# EAGLE design Pi MCU shield 2 (EAGLE 8.7.0)
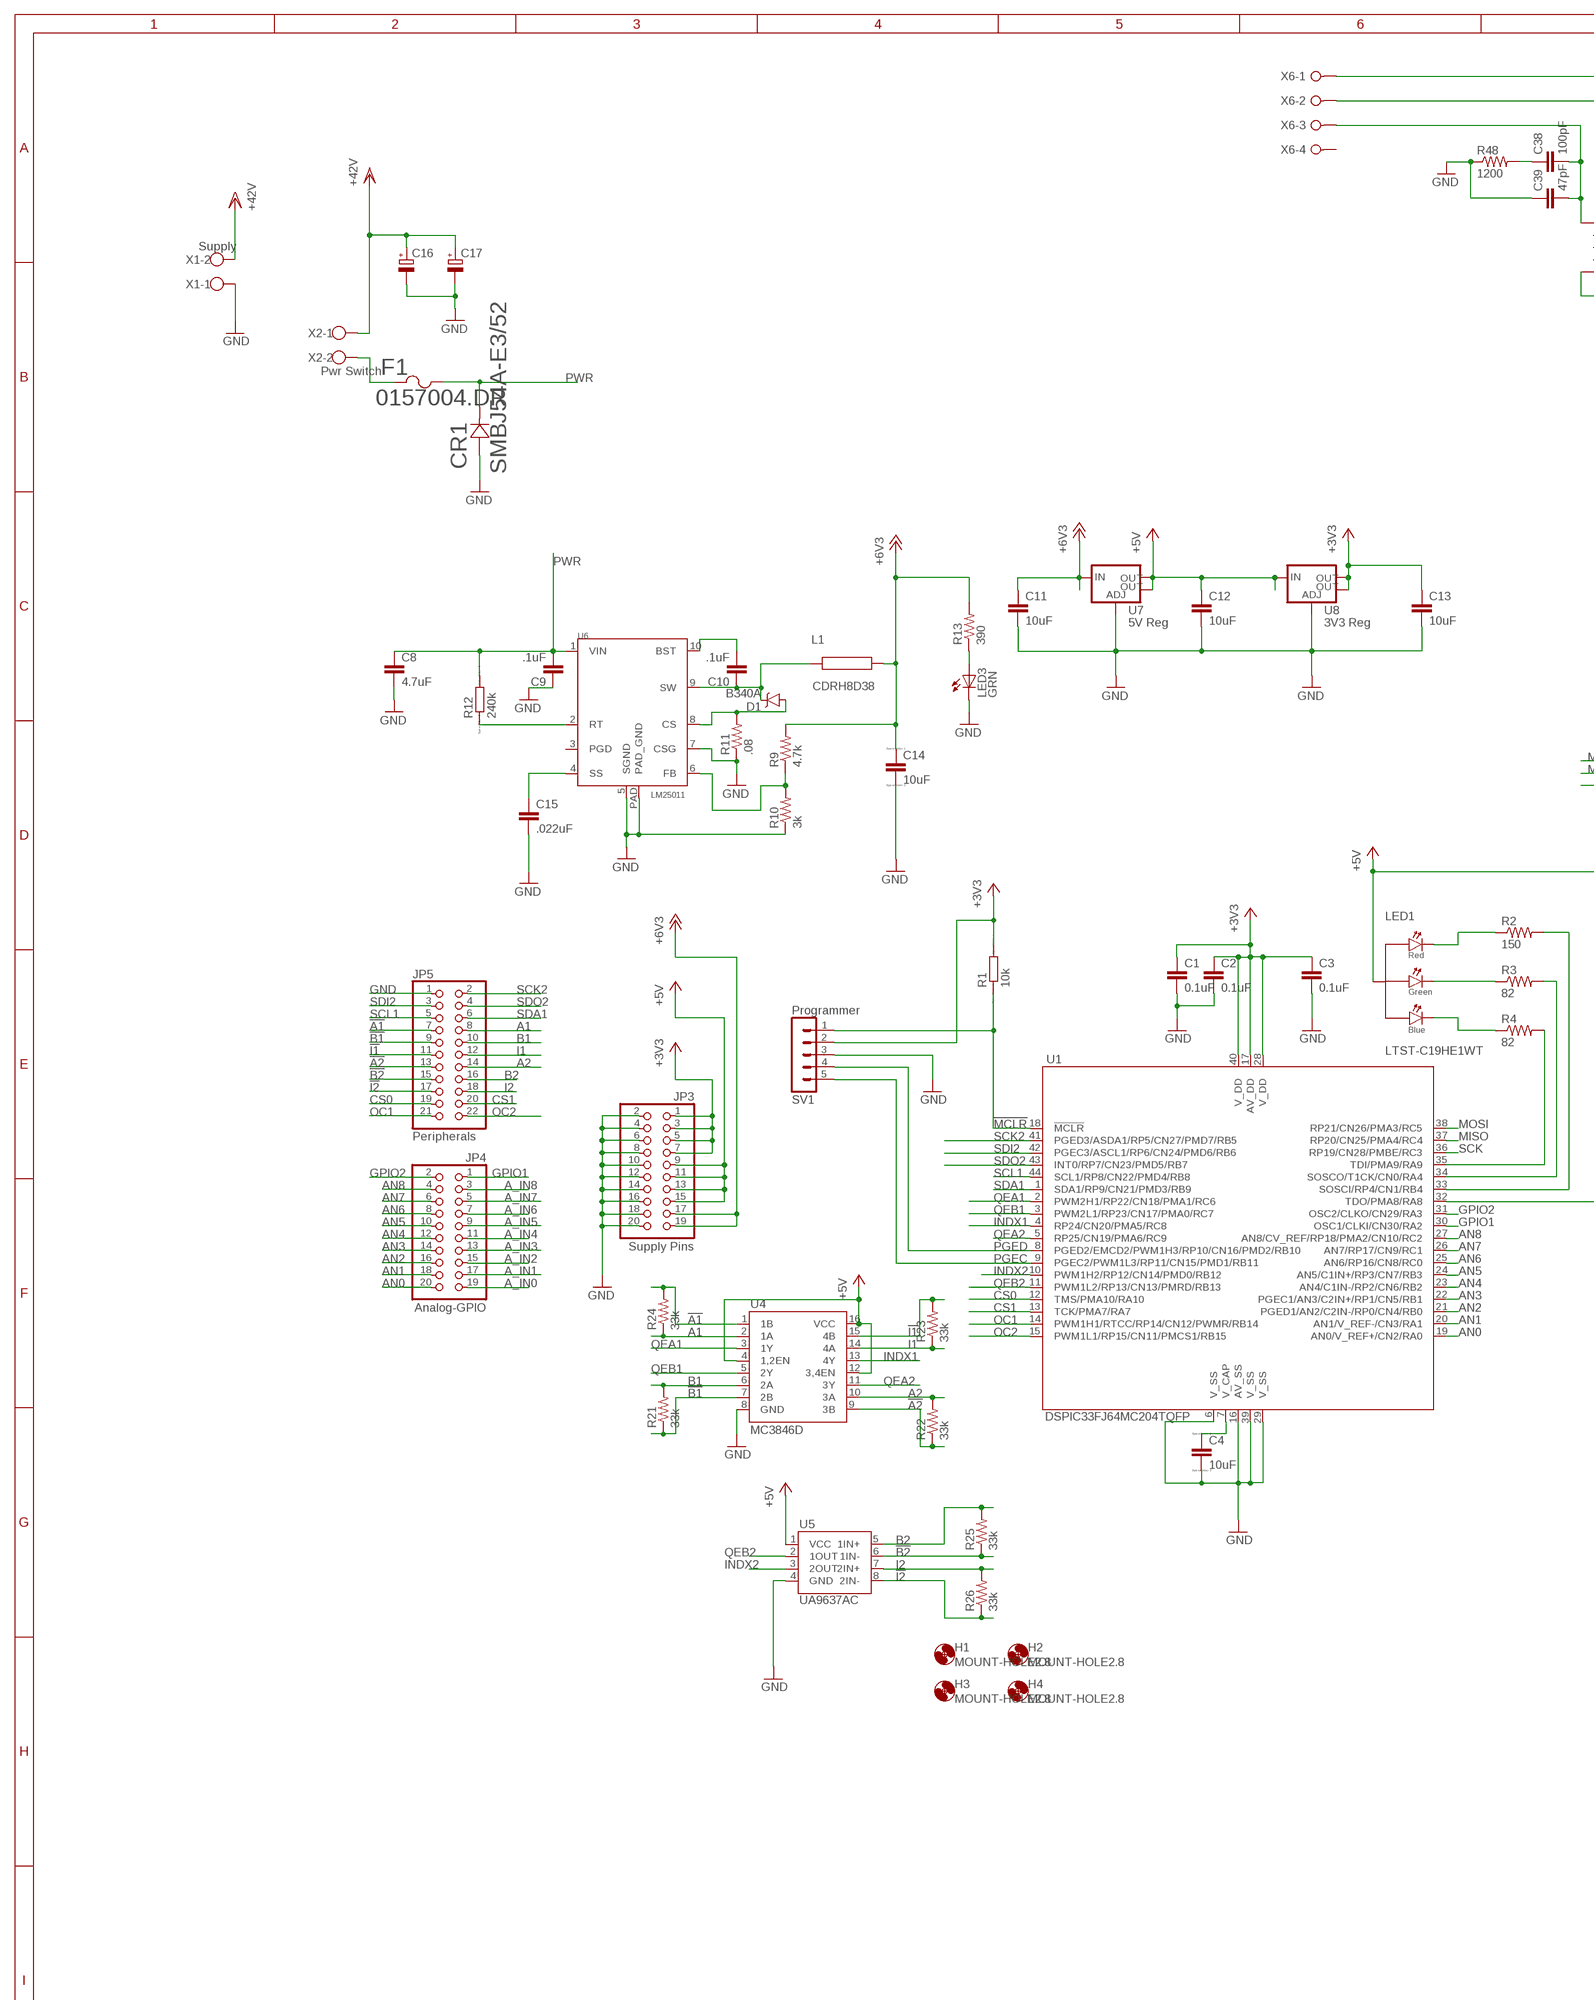
[diagram p0: schematic, sheet 1, part 1 of 2]
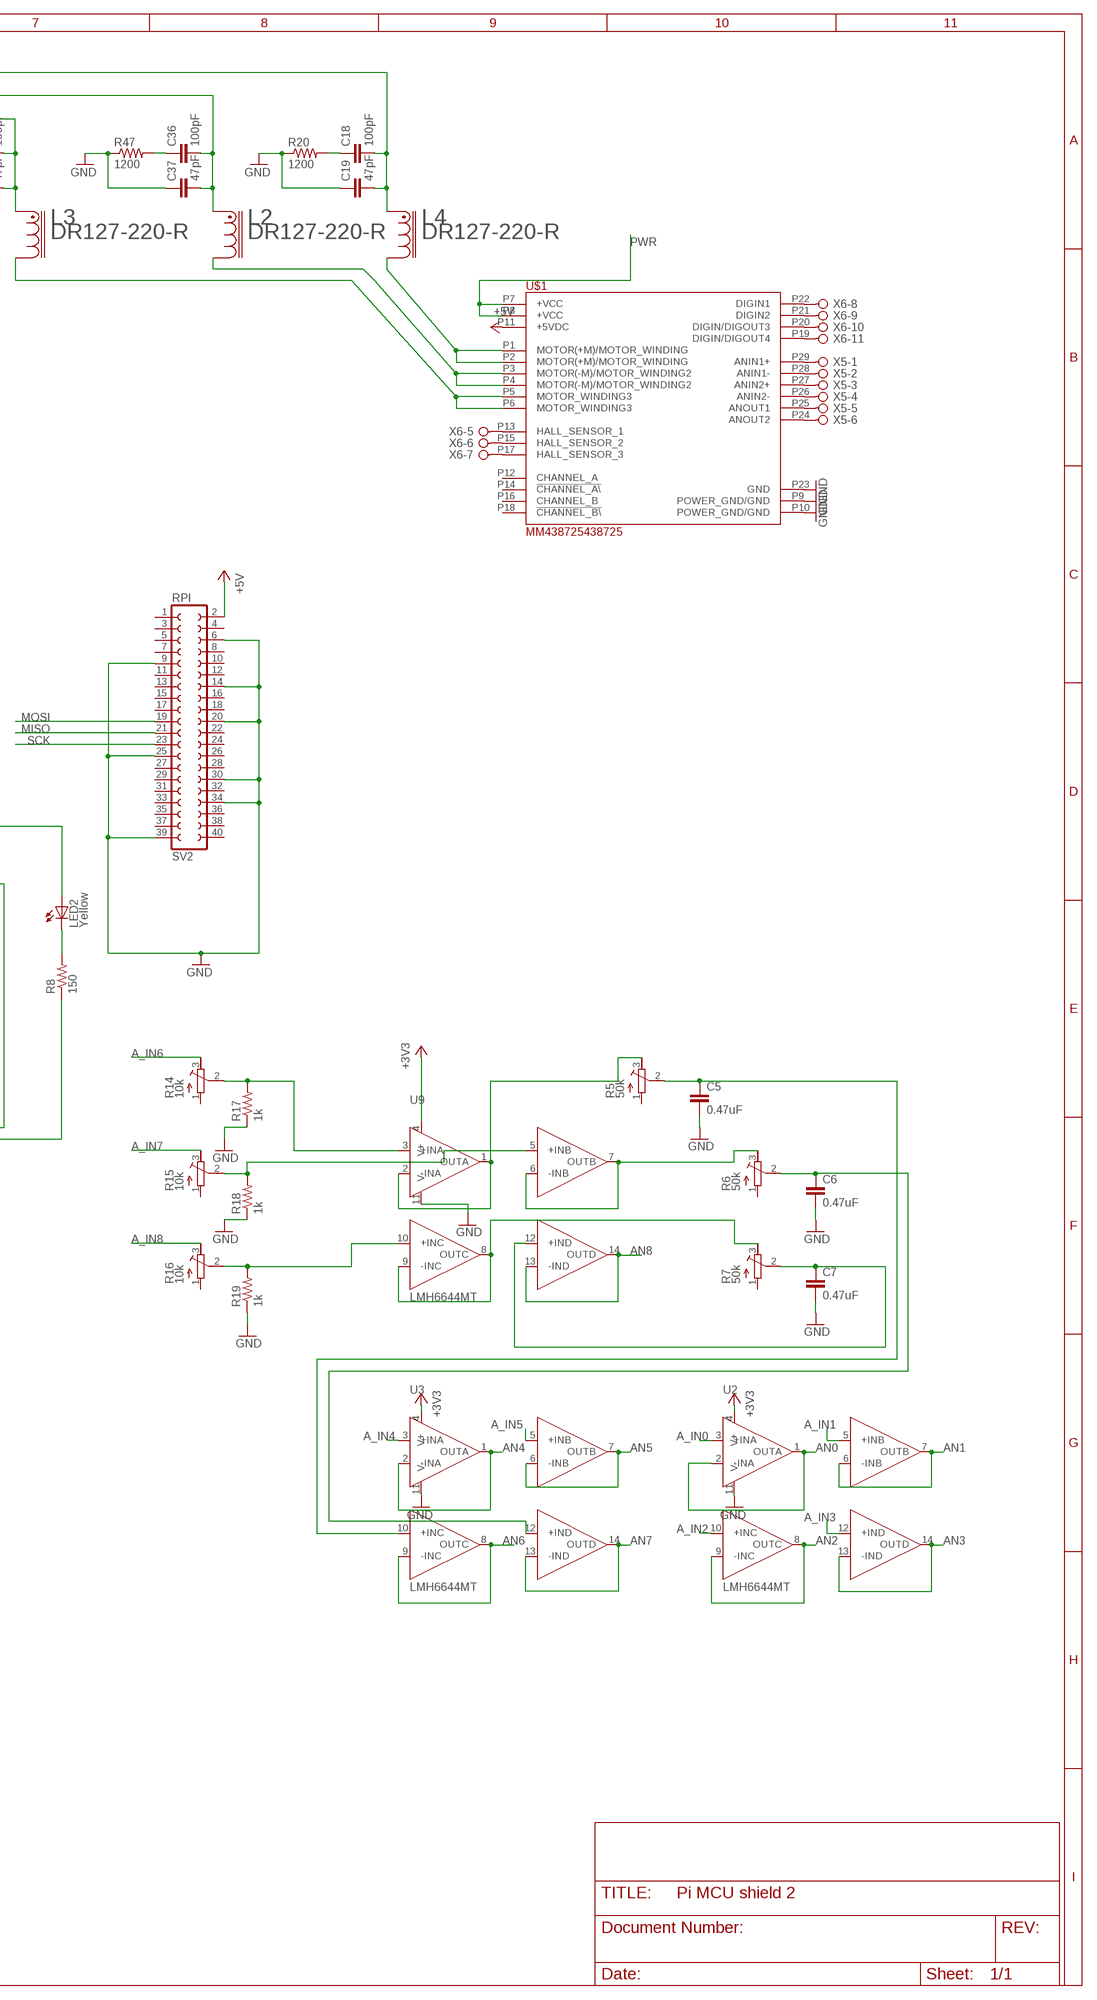
[diagram p1: schematic, sheet 1, part 2 of 2]

## Parts
C1  0.1uF  C-EUC0603  [C0603]
C2  0.1uF  C-EUC0603  [C0603]
C3  0.1uF  C-EUC0603  [C0603]
C4  10uF  CC1206  [C1206]
C5  0.47uF  C-EUC0603  [C0603]
C6  0.47uF  C-EUC0603  [C0603]
C7  0.47uF  C-EUC0603  [C0603]
C8  4.7uF  C-EUC1210  [C1210]
C9  .1uF  CAP0603-CAP  [0603-CAP]
C10  .1uF  CAP0603-CAP  [0603-CAP]
C11  10uF  C-EUC0805  [C0805]
C12  10uF  C-EUC0805  [C0805]
C13  10uF  C-EUC0805  [C0805]
C14  10uF  CC1206  [C1206]
C15  .022uF  CAP0603-CAP  [0603-CAP]
C16  CPOL-EUE5-13  [E5-13]
C17  CPOL-EUE5-13  [E5-13]
C18  100pF  CAP0603-CAP  [0603-CAP]
C19  47pF  CAP0603-CAP  [0603-CAP]
C36  100pF  CAP0603-CAP  [0603-CAP]
C37  47pF  CAP0603-CAP  [0603-CAP]
C38  100pF  CAP0603-CAP  [0603-CAP]
C39  47pF  CAP0603-CAP  [0603-CAP]
CR1  SMBJ54A-E3/52  [DIODE_DO-214AC]
D1  B340A  DIODE-SCHOTTKY-B340A  [SMA-DIODE]
F1  0157004.DR  [0157SERIES]
H1  MOUNT-HOLE2.8  [2,8]
H2  MOUNT-HOLE2.8  [2,8]
H3  MOUNT-HOLE2.8  [2,8]
H4  MOUNT-HOLE2.8  [2,8]
JP3  Supply Pins  PINHD-2X10  [2X10]
JP4  Analog-GPIO  PINHD-2X10  [2X10]
JP5  Peripherals  PINHD-2X11  [2X11]
L1  CDRH8D38  [CDRH8D38]
L2  DR127-220-R  [DR127]
L3  DR127-220-R  [DR127]
L4  DR127-220-R  [DR127]
LED1  LTST-C19HE1WT  [0606]
LED2  Yellow  LEDSML0603  [SML0603]
LED3  GRN  LEDCHIP-LED0805  [CHIP-LED0805]
R1  10k  R  [R0805]
R2  150  R-US_R0603  [R0603]
R3  82  R-US_R0603  [R0603]
R4  82  R-US_R0603  [R0603]
R5  50k  R-TRIMM3224J  [RTRIM3224J]
R6  50k  R-TRIMM3224J  [RTRIM3224J]
R7  50k  R-TRIMM3224J  [RTRIM3224J]
R8  150  R-US_R0603  [R0603]
R9  4.7k  RESISTOR0603-RES  [0603-RES]
R10  3k  RESISTOR0603-RES  [0603-RES]
R11  .08  RESISTOR0603-RES  [0603-RES]
R12  240k  R  [R0805]
R13  390  RESISTOR0603-RES  [0603-RES]
R14  10k  R-TRIMM3224J  [RTRIM3224J]
R15  10k  R-TRIMM3224J  [RTRIM3224J]
R16  10k  R-TRIMM3224J  [RTRIM3224J]
R17  1k  R-US_R0603  [R0603]
R18  1k  R-US_R0603  [R0603]
R19  1k  R-US_R0603  [R0603]
R20  1200  R-US_R0603  [R0603]
R21  33k  R-US_R0603  [R0603]
R22  33k  R-US_R0603  [R0603]
R23  33k  R-US_R0603  [R0603]
R24  33k  R-US_R0603  [R0603]
R25  33k  R-US_R0603  [R0603]
R26  33k  R-US_R0603  [R0603]
R47  1200  R-US_R0603  [R0603]
R48  1200  R-US_R0603  [R0603]
SV1  Programmer  MA05-1  [MA05-1]
SV2  RPI  FE20-2  [FE20-2]
U1  DSPIC33FJ64MC204TQFP  [TQFP44]
U2  LMH6644MT  [TSSOP14]
U3  LMH6644MT  [TSSOP14]
U4  MC3846D  [SO-16]
U5  UA9637AC  [SO-08]
U6  LM25011  [HVSS0P-10]
U7  5V Reg  V_REG_LM1117SOT223  [SOT223]
U8  3V3 Reg  V_REG_LM1117SOT223  [SOT223]
U9  LMH6644MT  [TSSOP14]
U$1  MM438725438725  [MAX_MOT_438725]
X1  Supply  W237-102  [W237-102]
X2  Pwr Switch  W237-102  [W237-102]
X5  W237-06P  [W237-6P]
X6  W237-11P  [W237-11P]

## Nets
!A1: JP5.7 R24.2 U4.1(1B)
!A2: JP5.13 R22.1 U4.9(3B)
!B1: JP5.9 R21.1 U4.7(2B)
!B2: JP5.15 R25.1 U5.6(1IN-)
!I1: JP5.11 R23.2 U4.15(4B)
!I2: JP5.17 R26.1 U5.8(2IN-)
!MCLR: R1.1 SV1.1 U1.18(!MCLR)
+3V3: C1.1 C2.1 C3.1 C13.1 JP3.1 JP3.3 JP3.5 JP3.7 R1.2 SV1.2 U1.17(AV_DD) U1.28(V_DD) U1.40(V_DD) U2.4(V+) U3.4(V+) U8.2(OUT) U8.4(OUT) U9.4(V+)
+5V: C12.1 JP3.9 JP3.11 JP3.13 JP3.15 LED1.4(ANODE) LED2.A SV2.2 U4.4(1,2EN) U4.12(3,4EN) U4.16(VCC) U5.1(VCC) U7.2(OUT) U7.4(OUT) U8.3(IN) U$1.P11(+5VDC)
+6V3: C11.1 C14.1 JP3.17 JP3.19 L1.P$2 R9.2 R13.2 U7.3(IN)
A1: JP5.8 R24.1 U4.2(1A)
A2: JP5.14 R22.2 U4.10(3A)
A_IN0: JP4.19 U2.3(+INA)
A_IN1: JP4.17 U2.5(+INB)
A_IN2: JP4.15 U2.10(+INC)
A_IN3: JP4.13 U2.12(+IND)
A_IN4: JP4.11 U3.3(+INA)
A_IN5: JP4.9 U3.5(+INB)
A_IN6: JP4.7 R14.3(E)
A_IN7: JP4.5 R15.3(E)
A_IN8: JP4.3 R16.3(E)
AN0: JP4.20 U1.19(AN0/V_REF+/CN2/RA0) U2.1(OUTA) U2.2(-INA)
AN1: JP4.18 U1.20(AN1/V_REF-/CN3/RA1) U2.6(-INB) U2.7(OUTB)
AN2: JP4.16 U1.21(PGED1/AN2/C2IN-/RP0/CN4/RB0) U2.8(OUTC) U2.9(-INC)
AN3: JP4.14 U1.22(PGEC1/AN3/C2IN+/RP1/CN5/RB1) U2.13(-IND) U2.14(OUTD)
AN4: JP4.12 U1.23(AN4/C1IN-/RP2/CN6/RB2) U3.1(OUTA) U3.2(-INA)
AN5: JP4.10 U1.24(AN5/C1IN+/RP3/CN7/RB3) U3.6(-INB) U3.7(OUTB)
AN6: JP4.8 U1.25(AN6/RP16/CN8/RC0) U3.8(OUTC) U3.9(-INC)
AN7: JP4.6 U1.26(AN7/RP17/CN9/RC1) U3.13(-IND) U3.14(OUTD)
AN8: JP4.4 U1.27(AN8/CV_REF/RP18/PMA2/CN10/RC2) U9.13(-IND) U9.14(OUTD)
B1: JP5.10 R21.2 U4.6(2A)
B2: JP5.16 R25.2 U5.5(1IN+)
BLUE: LED1.2(G_CATHODE) R3.1
CS0: JP5.19 U1.12(TMS/PMA10/RA10)
CS1: JP5.20 U1.13(TCK/PMA7/RA7)
GND: C1.2 C2.2 C3.2 C4.2 C5.2 C6.2 C7.2 C8.2 C9.1 C11.2 C12.2 C13.2 C14.2 C15.2 C16.- C17.- C19.1 C37.1 C39.1 CR1.2 JP3.2 JP3.4 JP3.6 JP3.8 JP3.10 JP3.12 JP3.14 JP3.16 JP3.18 JP3.20 JP5.1 LED3.C R10.1 R11.1 R17.1 R18.1 R19.1 R20.1 R47.1 R48.1 SV1.3 SV2.6 SV2.9 SV2.14 SV2.20 SV2.25 SV2.30 SV2.34 SV2.39 U1.6(V_SS) U1.16(AV_SS) U1.29(V_SS) U1.39(V_SS) U2.11(V-) U3.11(V-) U4.8(GND) U5.4(GND) U6.5(SGND) U6.7(CSG) U6.PAD(PAD_GND) U7.1(ADJ) U8.1(ADJ) U9.11(V-) U$1.P9(POWER_GND/GND) U$1.P10(POWER_GND/GND) U$1.P23(GND) X1.1
GPIO1: JP4.1 U1.30(OSC1/CLKI/CN30/RA2)
GPIO2: JP4.2 U1.31(OSC2/CLKO/CN29/RA3)
GREEN: LED1.3(B_CATHODE) R4.1
I1: JP5.12 R23.1 U4.14(4A)
I2: JP5.18 R26.2 U5.7(2IN+)
INDX1: U1.4(RP24/CN20/PMA5/RC8) U4.13(4Y)
INDX2: U1.10(PWM1H2/RP12/CN14/PMD0/RB12) U5.3(2OUT)
MISO: SV2.21 U1.37(RP20/CN25/PMA4/RC4)
MOSI: SV2.19 U1.38(RP21/CN26/PMA3/RC5)
N$1: R15.2(S) R18.2 U9.5(+INB)
N$2: C4.1 U1.7(V_CAP)
N$4: C7.1 R7.2(S) U9.12(+IND)
N$5: C5.1 R5.2(S) U3.10(+INC)
N$6: C18.2 C19.2 L4.1 X6.1
N$8: L4.2 U$1.P1(MOTOR(+M)/MOTOR_WINDING) U$1.P2(MOTOR(+M)/MOTOR_WINDING)
N$9: U$1.P13(HALL_SENSOR_1) X6.5
N$10: R14.2(S) R17.2 U9.3(+INA)
N$11: C18.1 R20.2
N$12: U$1.P15(HALL_SENSOR_2) X6.6
N$13: U$1.P17(HALL_SENSOR_3) X6.7
N$14: U$1.P22(DIGIN1) X6.8
N$15: U$1.P21(DIGIN2) X6.9
N$16: R6.3(E) U9.6(-INB) U9.7(OUTB)
N$17: U$1.P20(DIGIN/DIGOUT3) X6.10
N$18: R7.3(E) U9.8(OUTC) U9.9(-INC)
N$19: U$1.P19(DIGIN/DIGOUT4) X6.11
N$20: U$1.P29(ANIN1+) X5.1
N$21: U$1.P28(ANIN1-) X5.2
N$22: U$1.P27(ANIN2+) X5.3
N$23: LED3.A R13.1
N$24: C36.2 C37.2 L2.1 X6.2
N$25: LED2.C R8.2
N$26: U$1.P26(ANIN2-) X5.4
N$27: U$1.P25(ANOUT1) X5.5
N$28: R4.2 U1.35(TDI/PMA9/RA9)
N$29: R3.2 U1.34(SOSCO/T1CK/CN0/RA4)
N$30: R2.2 U1.33(SOSCI/RP4/CN1/RB4)
N$31: R16.2(S) R19.2 U9.10(+INC)
N$32: R8.1 U1.32(TDO/PMA8/RA8)
N$33: C10.1 D1.C L1.P$1 U6.9(SW)
N$34: U$1.P24(ANOUT2) X5.6
N$35: R9.1 R10.2 U6.6(FB)
N$36: R12.1 U6.2(RT)
N$37: C15.1 U6.4(SS)
N$38: D1.A R11.2 U6.8(CS)
N$39: C10.2 U6.10(BST)
N$41: C36.1 R47.2
N$44: R5.3(E) U9.1(OUTA) U9.2(-INA)
N$57: C6.1 R6.2(S) U3.12(+IND)
N$62: C38.2 C39.2 L3.1 X6.3
N$64: C38.1 R48.2
N$65: L2.2 U$1.P3(MOTOR(-M)/MOTOR_WINDING2) U$1.P4(MOTOR(-M)/MOTOR_WINDING2)
N$66: L3.2 U$1.P5(MOTOR_WINDING3) U$1.P6(MOTOR_WINDING3)
OC1: JP5.21 U1.14(PWM1H1/RTCC/RP14/CN12/PWMR/RB14)
OC2: JP5.22 U1.15(PWM1L1/RP15/CN11/PMCS1/RB15)
PGEC: SV1.5 U1.9(PGEC2/PWM1L3/RP11/CN15/PMD1/RB11)
PGED: SV1.4 U1.8(PGED2/EMCD2/PWM1H3/RP10/CN16/PMD2/RB10)
PWR: C8.1 C9.2 CR1.1 F1.2 R12.2 U6.1(VIN) U$1.P7(+VCC) U$1.P8(+VCC)
PWR-PREFUSE: F1.1 X2.2
QEA1: U1.2(PWM2H1/RP22/CN18/PMA1/RC6) U4.3(1Y)
QEA2: U1.5(RP25/CN19/PMA6/RC9) U4.11(3Y)
QEB1: U1.3(PWM2L1/RP23/CN17/PMA0/RC7) U4.5(2Y)
QEB2: U1.11(PWM1L2/RP13/CN13/PMRD/RB13) U5.2(1OUT)
RED: LED1.1(R_CATHODE) R2.1
SCK: SV2.23 U1.36(RP19/CN28/PMBE/RC3)
SCK2: JP5.2 U1.41(PGED3/ASDA1/RP5/CN27/PMD7/RB5)
SCL1: JP5.5 U1.44(SCL1/RP8/CN22/PMD4/RB8)
SDA1: JP5.6 U1.1(SDA1/RP9/CN21/PMD3/RB9)
SDI2: JP5.3 U1.42(PGEC3/ASCL1/RP6/CN24/PMD6/RB6)
SDO2: JP5.4 U1.43(INT0/RP7/CN23/PMD5/RB7)
VDD: C16.+ C17.+ X1.2 X2.1 ; supply symbol labelled +42V
Unconnected: R5.1(A) R6.1(A) R7.1(A) R14.1(A) R15.1(A) R16.1(A) SV2.1 SV2.3 SV2.4 SV2.5 SV2.7 SV2.8 SV2.10 SV2.11 SV2.12 SV2.13 SV2.15 SV2.16 SV2.17 SV2.18 SV2.22 SV2.24 SV2.26 SV2.27 SV2.28 SV2.29 SV2.31 SV2.32 SV2.33 SV2.35 SV2.36 SV2.37 SV2.38 SV2.40 U6.3(PGD) U$1.P12(CHANNEL_A) U$1.P14(!CHANNEL_A\) U$1.P16(CHANNEL_B) U$1.P18(!CHANNEL_B\) X6.4

## Library data of the parts
C1-C3 C5-C8 C11-C13 = resistor:C-EU: CAPACITOR, European symbol
C4 C14 = eagle-ltspice:C: CAPACITOR, European symbol; SPICEMODEL: NONE; SPICEPREFIX: C
C9 C10 C15 C18 C19 C36-C39 = SparkFun-Capacitors:CAP: Capacitor Standard 0603 ceramic capacitor, and 0.1" leaded capacitor.
C16 C17 = resistor:CPOL-EU: POLARIZED CAPACITOR, European symbol
CR1 = vishaydiode:SMBJ54A-E3/52; MANUFACTURER_PART_NUMBER: SMBJ54AE352; VENDOR: Vishay
D1 = SparkFun-DiscreteSemi:DIODE-SCHOTTKY: Schottky diodes in SFE's production catalog BAT20J 1A 23V 0.62Vf RB751 120mA 40V 0.37Vf PMEG4005EJ 0.5A 40V 0.42Vf MBRA140 1A 40V 0.5Vf B340A 3A 40V SMA; PROD_ID: DIO-09886
F1 = lilfuse:0157004.DR; MANUFACTURER_PART_NUMBER: 0157004.DR; VENDOR: Littelfuse Inc
H1-H4 = holes:MOUNT-HOLE: MOUNTING HOLE with drill center marker
JP3 JP4 = pinhead:PINHD-2X10: PIN HEADER
JP5 = pinhead:PINHD-2X11: PIN HEADER
L1 = sumida:CDRH8D38: Power Inductor - 1.8uH to 100 uH, 4mm tall, shielded
L2-L4 = wurth:DR127-220-R; MANUFACTURER_PART_NUMBER: DR127220R; VENDOR: Cooper Bussmann
LED1 = led:LTST-C19HE1WT: RGB LED, common cathode. Vf ~ 3.3V (B, G), 2.1V (R) at 20mA.
LED2 LED3 = led:LED: LED OSRAM: - CHIPLED LG R971, LG N971, LY N971, LG Q971, LY Q971, LO R971, LY R971 LH N974, LH R974 LS Q976, LO Q976, LY Q976 LO Q996 - Hyper CHIPLED LW Q18S LB Q993, LB Q99A, LB R99A - SideLED LS A670, LO A670, LY A670, LG A670, LP A670 LB A673, LV A673, LT A673, LW A673 LH A674 LY A675 LS A676, LA A676, LO A676, LY A676, LW A676 LS A679, LY A679, LG A679 - Hyper Micro SIDELED® LS Y876, LA Y876, LO Y876, LY Y876 LT Y87S - SmartLED LW L88C, LW L88S LB L89C, LB L89S, LG L890 LS L89K, LO L89K, LY L89K LS L896, LA L896, LO L896, LY L896 - TOPLED LS T670, LO T670, LY T670, LG T670, LP T670 LSG T670, LSP T670, LSY T670, LOP T670, LYG T670 LG T671, LOG T671, LSG T671 LB T673, LV T673, LT T673, LW T673 LH T674 LS T676, LA T676, LO T676, LY T676, LB T676, LH T676, LSB T676, LW T676 LB T67C, LV T67C, LT T67C, LS T67K, LO T67K, LY T67K, LW E67C LS E67B, LA E67B, LO E67B, LY E67B, LB E67C, LV E67C, LT E67C LW T67C LS T679, LY T679, LG T679 LS T770, LO T770, LY T770, LG T770, LP T770 LB T773, LV T773, LT T773, LW T773 LH T774 LS E675, LA E675, LY E675, LS T675 LS T776, LA T776, LO T776, LY T776, LB T776 LHGB T686 LT T68C, LB T68C - Hyper Mini TOPLED® LB M676 - Mini TOPLED Santana® LG M470 LS M47K, LO M47K, LY M47K Source: http://www.osram.convergy.de LUXEON: - LUMILED® LXK2-PW12-R00, LXK2-PW12-S00, LXK2-PW14-U00, LXK2-PW14-V00 LXK2-PM12-R00, LXK2-PM12-S00, LXK2-PM14-U00 LXK2-PE12-Q00, LXK2-PE12-R00, LXK2-PE12-S00, LXK2-PE14-T00, LXK2-PE14-U00 LXK2-PB12-K00, LXK2-PB12-L00, LXK2-PB12-M00, LXK2-PB14-N00, LXK2-PB14-P00, LXK2-PB14-Q00 LXK2-PR12-L00, LXK2-PR12-M00, LXK2-PR14-Q00, LXK2-PR14-R00 LXK2-PD12-Q00, LXK2-PD12-R00, LXK2-PD12-S00 LXK2-PH12-R00, LXK2-PH12-S00 LXK2-PL12-P00, LXK2-PL12-Q00, LXK2-PL12-R00 Source: www.luxeon.com KINGBRIGHT: KA-3528ASYC Source: www.kingbright.com
R1 R12 = eagle-ltspice:R: RESISTOR, European symbol; SPICEMODEL: NONE; SPICEPREFIX: R
R2-R4 R8 R17-R26 R47 R48 = resistor:R-US_: RESISTOR, American symbol
R5-R7 R14-R16 = rcl:R-TRIMM: Trimm resistor
R9-R11 R13 = SparkFun-Resistors:RESISTOR: Resistor Basic schematic elements and footprints for 0603, 1206, and PTH resistors.
SV1 = con-lstb:MA05-1: PIN HEADER; OC_FARNELL: unknown; OC_NEWARK: unknown
SV2 = con-lsta:FE20-2: FEMALE HEADER; OC_FARNELL: unknown; OC_NEWARK: unknown
U1 = microchip:DSPIC33FJ64MC204: A 16-bit microcontroller/digital signal processor with 26 reprogrammable i/o pins,35 total i/o pins, and support for encoders, pwm output (output compare), input capture, SPI/I2C/UART serial communication, and 9 ADC channels.
U2 U3 U9 = texas:LMH6644: Fast op amps for ADC buffering. 130 MHz, full power bandwidth 40MHz, 130V/us slew rate.
U4 = texas:MC3846: Quadruple differential line receiver. 5V supply, 3 state output.
U5 = texas:UA9637AC: Dual differential line receiver, 5V supply, 8 pins.
U6 = SparkFun-PowerIC:LM25011: The LM25011 constant on-time step-down switching regulator features all the functions needed to implement a low-cost, efficient, buck bias regulator capable of supplying up to 2 A of load current. This high-voltage regulator contains an N-Channel Buck switch, a startup regulator, current limit detection, and internal ripple control.; PROD_ID: IC-12528
U7 U8 = SparkFun-PowerIC:V_REG_LM1117: Voltage Regulator LM1117 Standard adjustable voltage regulator but in SMD form. Spark Fun Electronics SKU : COM-00595; PROD_ID: VREG-08170
U$1 = Misc:MM438725: Schematic component for the ESCON Module 50/5 Servo Controller P/N 438725. More information here: https://www.maxonmotor.com/medias/sys_master/root/8818448859166/438725-ESCON-Module-50-5-Hardware-Reference-En.pdf
X1 X2 = con-wago-500:W237-102: WAGO SCREW CLAMP; MPN: 237-102; OC_FARNELL: unknown; OC_NEWARK: 70K9898
X5 = con-wago-508:W237-06P: WAGO SREW CLAMP; OC_FARNELL: unknown; OC_NEWARK: unknown
X6 = con-wago-508:W237-11P: WAGO SREW CLAMP; OC_FARNELL: unknown; OC_NEWARK: unknown

## Board
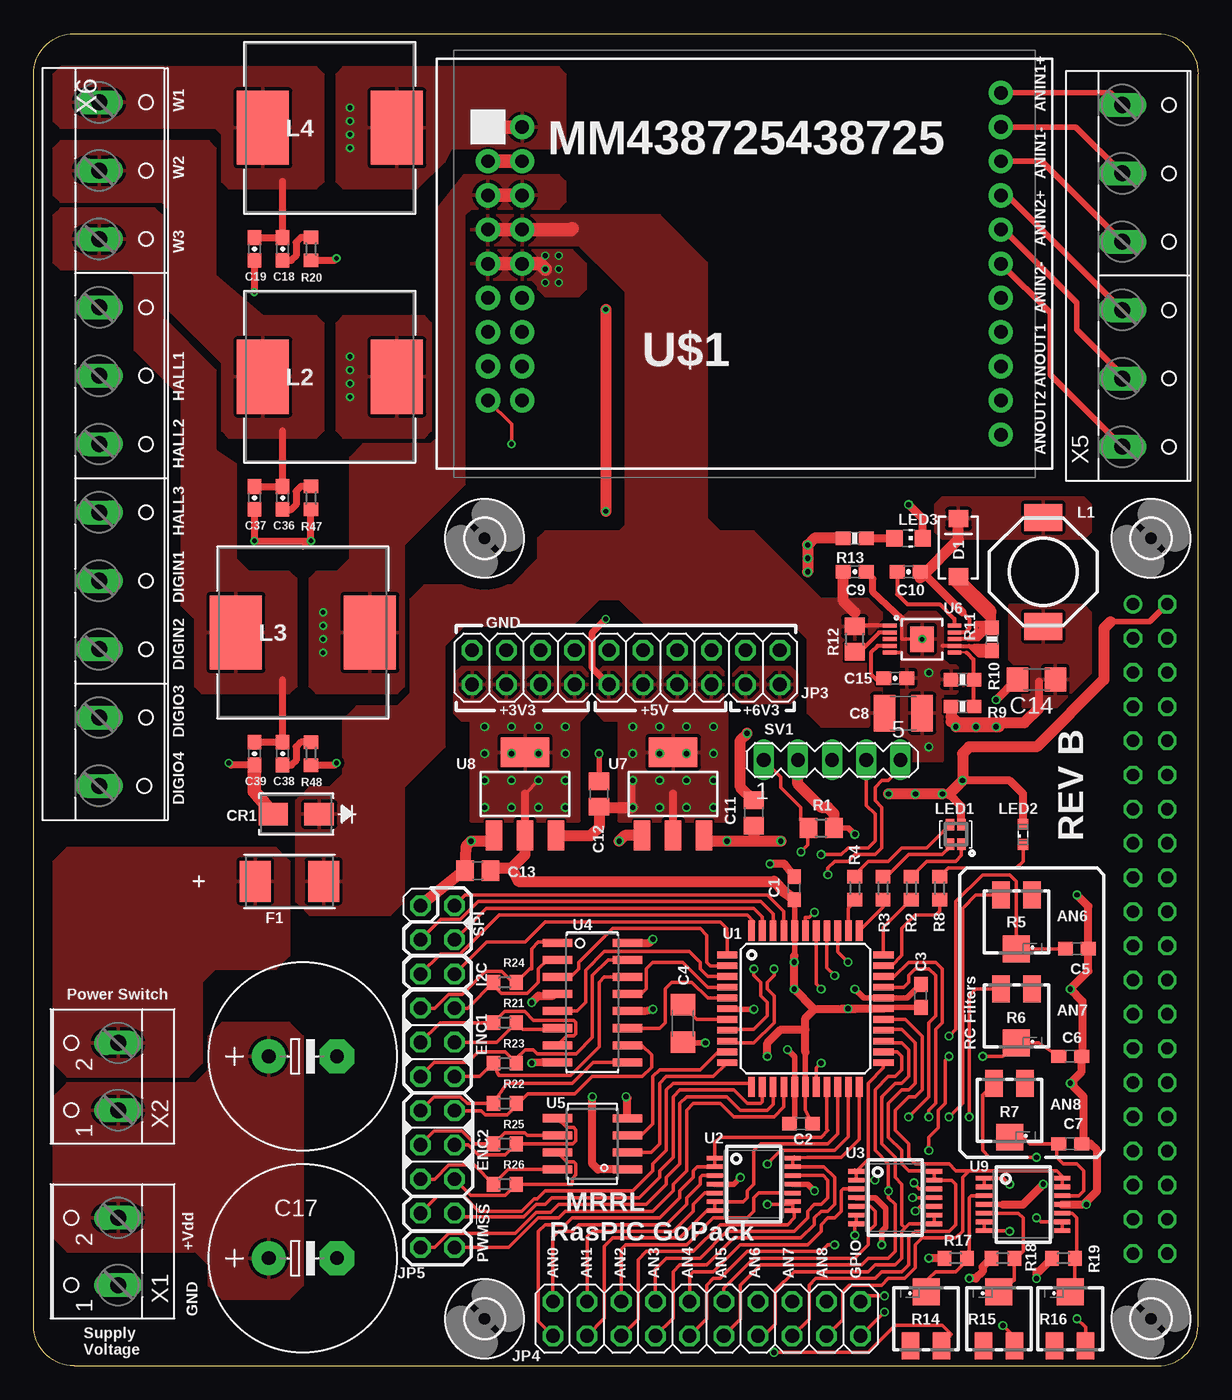
[diagram p2: board, top side]
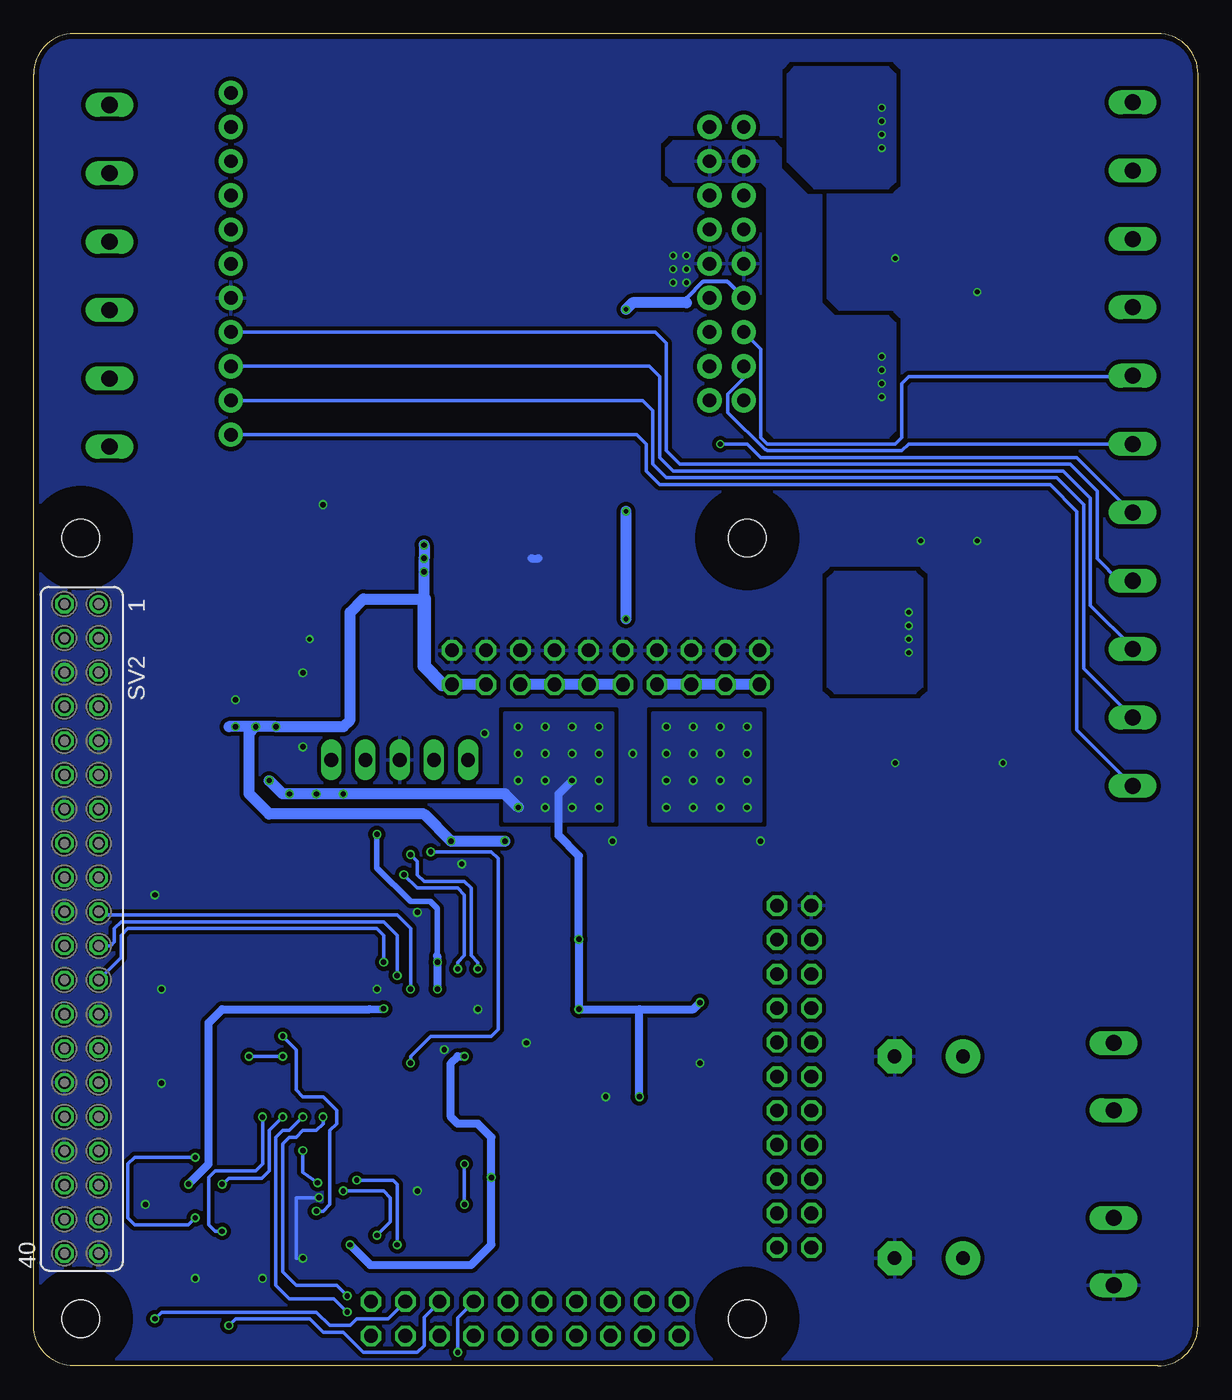
[diagram p3: board, bottom side, seen from below]

Size 86.5 x 99 mm. Coordinates in mm from the lower left corner, seen from the top.
Outline: 3,0 83.5,0 arc90 86.5,3 86.5,96 arc90 83.5,99 3,99 arc90 0,96 0,3 arc90 3,0
Copper layers (1*16): Top 0.035559375mm / dielectric 1.6mm / Bottom 0.035559375mm
Design rules "oshpark-2layer": minimum track width 6mil, minimum drill 10mil, track to track 6mil, track to pad 6mil, pad to pad 6mil, via to via 6mil, smd to smd 6mil, copper to edge 15mil, drill to drill 6mil, minimum pad ring 5mil, minimum via ring 5mil, stop-mask expansion 2.5mil, vias tented up to drill 0mil, thermal gap 10mil

### Footprints (pad centres in the part's own frame; a part is rotated, then mirrored left to right if it is on the bottom)
C0603 = smd 1.1 x 1: 1 -0.85,0; 2 0.85,0
C1206 = smd 1.6 x 1.8: 1 -1.4,0; 2 1.4,0
C1210 = smd 1.6 x 2.7: 1 -1.4,0; 2 1.4,0
0603-CAP = smd 1.1 x 1: 1 -0.85,0; 2 0.85,0
C0805 = smd 1.3 x 1.5: 1 -0.95,0; 2 0.95,0
E5-13 = drill 1.016 pad 2.54: + -2.54,0 | drill 1.016 pad 2.54 octagon: - 2.54,0
DIODE_DO-214AC = smd 2.184 x 1.651: 1 -1.702,0; 2 1.702,0
SMA-DIODE = smd 1.27 x 1.47: A -2.15,0; C 2.15,0
0157SERIES = smd 2.286 x 3.048: 1 -2.54,0; 2 2.54,0
2,8 = hole 2.8: 0,0
2X10 = drill 1.016 octagon: 1 -11.43,-1.27; 2 -11.43,1.27; 3 -8.89,-1.27; 4 -8.89,1.27; 5 -6.35,-1.27; 6 -6.35,1.27; 7 -3.81,-1.27; 8 -3.81,1.27; 9 -1.27,-1.27; 10 -1.27,1.27; 11 1.27,-1.27; 12 1.27,1.27; 13 3.81,-1.27; 14 3.81,1.27; 15 6.35,-1.27; 16 6.35,1.27; 17 8.89,-1.27; 18 8.89,1.27; 19 11.43,-1.27; 20 11.43,1.27
2X11 = drill 1.016 octagon: 1 -12.7,-1.27; 2 -12.7,1.27; 3 -10.16,-1.27; 4 -10.16,1.27; 5 -7.62,-1.27; 6 -7.62,1.27; 7 -5.08,-1.27; 8 -5.08,1.27; 9 -2.54,-1.27; 10 -2.54,1.27; 11 0,-1.27; 12 0,1.27; 13 2.54,-1.27; 14 2.54,1.27; 15 5.08,-1.27; 16 5.08,1.27; 17 7.62,-1.27; 18 7.62,1.27; 19 10.16,-1.27; 20 10.16,1.27; 21 12.7,-1.27; 22 12.7,1.27
CDRH8D38 = smd 2 x 2.8: P$1 4.05,0; P$2 -4.05,0
DR127 = smd 3.861 x 5.512: 1 -4.978,0; 2 4.978,0
0606 = smd 0.65 x 0.85: 1 -0.425,0.725; 2 0.425,0.725; 3 0.425,-0.725; 4 -0.425,-0.725
SML0603 = smd 0.8 x 0.8: A 0.75,0; C -0.75,0
CHIP-LED0805 = smd 1.2 x 1.2: A 0,-1.05; C 0,1.05
R0805 = smd 1.3 x 1.5: 1 -0.95,0; 2 0.95,0
R0603 = smd 1 x 1.1: 1 -0.85,0; 2 0.85,0
RTRIM3224J = smd 1.3 x 2: 1 -1.15,-2; 3 1.15,-2 | smd 2 x 2: 2 0,2
0603-RES = smd 1.1 x 1: 1 -0.85,0; 2 0.85,0
MA05-1 = drill 1.016 long: 1 -5.08,0; 2 -2.54,0; 3 0,0; 4 2.54,0; 5 5.08,0
FE20-2 = drill 0.914: 1 -24.13,1.27 | drill 0.914 octagon: 2 -24.13,-1.27; 3 -21.59,1.27; 4 -21.59,-1.27; 5 -19.05,1.27; 6 -19.05,-1.27; 7 -16.51,1.27; 8 -16.51,-1.27; 9 -13.97,1.27; 10 -13.97,-1.27; 11 -11.43,1.27; 12 -11.43,-1.27; 13 -8.89,1.27; 14 -8.89,-1.27; 15 -6.35,1.27; 16 -6.35,-1.27; 17 -3.81,1.27; 18 -3.81,-1.27; 19 -1.27,1.27; 20 -1.27,-1.27; 21 1.27,1.27; 22 1.27,-1.27; 23 3.81,1.27; 24 3.81,-1.27; 25 6.35,1.27; 26 6.35,-1.27; 27 8.89,1.27; 28 8.89,-1.27; 29 11.43,1.27; 30 11.43,-1.27; 31 13.97,1.27; 32 13.97,-1.27; 33 16.51,1.27; 34 16.51,-1.27; 35 19.05,1.27; 36 19.05,-1.27; 37 21.59,1.27; 38 21.59,-1.27; 39 24.13,1.27; 40 24.13,-1.27
TQFP44 = smd 1.5 x 0.5: 1 -5.8,4; 2 -5.8,3.2; 3 -5.8,2.4; 4 -5.8,1.6; 5 -5.8,0.8; 6 -5.8,0; 7 -5.8,-0.8; 8 -5.8,-1.6; 9 -5.8,-2.4; 10 -5.8,-3.2; 11 -5.8,-4; 23 5.8,-4; 24 5.8,-3.2; 25 5.8,-2.4; 26 5.8,-1.6; 27 5.8,-0.8; 28 5.8,0; 29 5.8,0.8; 30 5.8,1.6; 31 5.8,2.4; 32 5.8,3.2; 33 5.8,4 | smd 0.5 x 1.5: 12 -4,-5.8; 13 -3.2,-5.8; 14 -2.4,-5.8; 15 -1.6,-5.8; 16 -0.8,-5.8; 17 0,-5.8; 18 0.8,-5.8; 19 1.6,-5.8; 20 2.4,-5.8; 21 3.2,-5.8; 22 4,-5.8; 34 4,5.8; 35 3.2,5.8; 36 2.4,5.8; 37 1.6,5.8; 38 0.8,5.8; 39 0,5.8; 40 -0.8,5.8; 41 -1.6,5.8; 42 -2.4,5.8; 43 -3.2,5.8; 44 -4,5.8
TSSOP14 = smd 0.35 x 1.2: 1 -1.95,-2.9; 2 -1.3,-2.9; 3 -0.65,-2.9; 4 0,-2.9; 5 0.65,-2.9; 6 1.3,-2.9; 7 1.95,-2.9; 8 1.95,2.9; 9 1.3,2.9; 10 0.65,2.9; 11 0,2.9; 12 -0.65,2.9; 13 -1.3,2.9; 14 -1.95,2.9
SO-16 = smd 0.6 x 2.2: 1 -4.445,-2.6; 2 -3.175,-2.6; 3 -1.905,-2.6; 4 -0.635,-2.6; 5 0.635,-2.6; 6 1.905,-2.6; 7 3.175,-2.6; 8 4.445,-2.6; 9 4.445,2.6; 10 3.175,2.6; 11 1.905,2.6; 12 0.635,2.6; 13 -0.635,2.6; 14 -1.905,2.6; 15 -3.175,2.6; 16 -4.445,2.6
SO-08 = smd 0.6 x 2.2: 1 -1.905,-2.6; 2 -0.635,-2.6; 3 0.635,-2.6; 4 1.905,-2.6; 6 0.635,2.6; 7 -0.635,2.6; 8 -1.905,2.6 | smd 0.61 x 2.2: 5 1.905,2.6
HVSS0P-10 = smd 0.3 x 1.02: 1 -1,-2.4; 2 -0.5,-2.4; 3 0,-2.4; 4 0.5,-2.4; 5 1,-2.4; 6 1,2.4; 7 0.5,2.4; 8 0,2.4; 9 -0.5,2.4; 10 -1,2.4 | smd 1.905 x 1.727: PAD 0,0
SOT223 = smd 1.219 x 2.235: 1 -2.311,-3.099; 2 0,-3.099; 3 2.311,-3.099 | smd 3.6 x 2.2: 4 0,3.099
MAX_MOT_438725 = drill 1 pad 1.8: P1 -19.05,10.16; P2 -16.51,10.16; P3 -19.05,7.62; P4 -16.51,7.62; P5 -19.05,5.08; P6 -16.51,5.08; P7 -19.05,2.54; P8 -16.51,2.54; P9 -19.05,0; P10 -16.51,0; P11 -19.05,-2.54; P12 -16.51,-2.54; P13 -19.05,-5.08; P14 -16.51,-5.08; P15 -19.05,-7.62; P16 -16.51,-7.62; P17 -19.05,-10.16; P18 -16.51,-10.16; P19 19.05,-12.7; P20 19.05,-10.16; P21 19.05,-7.62; P22 19.05,-5.08; P23 19.05,-2.54; P24 19.05,0; P25 19.05,2.54; P26 19.05,5.08; P27 19.05,7.62; P28 19.05,10.16; P29 19.05,12.7
W237-102 = drill 1.194 long: 1 -2.5,-1.27; 2 2.5,-1.27
W237-6P = drill 1.194 long: 1 -12.7,-0.635; 2 -7.62,-0.635; 3 -2.54,-0.635; 4 2.54,-0.635; 5 7.62,-0.635; 6 12.7,-0.635
W237-11P = drill 1.194 long: 1 -25.4,-0.635; 2 -20.32,-0.635; 3 -15.24,-0.635; 4 -10.16,-0.635; 5 -5.08,-0.635; 6 0,-0.635; 7 5.08,-0.635; 8 10.16,-0.635; 9 15.24,-0.635; 10 20.32,-0.635; 11 25.4,-0.635

### Placement (x,y rotation side)
C1  56.5,35.5 90 top
C2  57,18 180 top
C3  65.9,27.5 90 top
C4  48.23,25.46 270 top
C5  77.5,31 0 top
C6  77,23 0 top
C7  77,16.5 0 top
C8  64.6,48.5 0 top
C9  61,59 180 top
C10  65,59 180 top
C11  53.5,41.1 90 top
C12  42,42.5 90 top
C13  33,36.8 180 top
C14  74.5,51 180 top
C15  64,51.1 0 top
C16  20,23 0 top
C17  20,8 0 top
C18  18.5,83 90 top
C19  16.4,83 90 top
C36  18.5,64.5 90 top
C37  16.4,64.5 90 top
C38  18.5,45.5 90 top
C39  16.4,45.5 90 top
CR1  19.5,41 180 top
D1  68.7,60.8 90 top
F1  19,36 0 top
H1  33.5,3.5 0 top
H2  83,3.5 0 top
H3  33.5,61.5 0 top
H4  83,61.5 0 top
JP3  44,51.9 0 top
JP4  50,3.5 180 top
JP5  30,21.5 270 top
L1  75,59 90 top
L2  22,73.5 0 top
L3  20,54.5 0 top
L4  22,92 0 top
LED1  68.5,39.5 180 top
LED2  73.5,39.5 90 top
LED3  65,61.5 270 top
R1  58.5,39.97 0 top
R2  65.2,35.5 270 top
R3  63.1,35.5 270 top
R4  61,35.5 270 top
R5  73,33 180 top
R6  73,26 180 top
R7  72.5,19 180 top
R8  67.3,35.5 90 top
R9  69,49 180 top
R10  69,51 0 top
R11  71.2,54 90 top
R12  61,54 90 top
R13  61,61.5 180 top
R14  66.3,3.5 0 top
R15  71.7,3.5 0 top
R16  77,3.5 0 top
R17  68.5,8 0 top
R18  72,8 0 top
R19  76.5,8 0 top
R20  20.6,83 90 top
R21  35,25.5 0 top
R22  35,19.5 0 top
R23  35,22.5 0 top
R24  35,28.5 0 top
R25  35,16.5 0 top
R26  35,13.5 0 top
R47  20.6,64.5 90 top
R48  20.6,45.5 90 top
SV1  59.31,45.03 0 top
SV2  82.94,32.48 270 bottom
U1  57.33,26.54 0 top
U2  53.5,13.5 270 top
U3  64,12.5 270 top
U4  41.5,27 270 top
U5  41.5,16.5 90 top
U6  66,54 270 top
U7  47.5,42.5 0 top
U8  36.5,42.5 0 top
U9  73.5,12 270 top
U$1  52.8,81.9 0 top
X1  5,8.5 90 top
X2  5,21.5 90 top
X5  81.5,81 270 top
X6  5.5,68.5 270 top

### Tracks (layer width: path | path; a pad name or v marks a point on that pad's centre or on a via)
!A1
  Top 0.254: 38.05,31.45 U4.1 38.65,31.5 37.5,31.5 37,31 37,29.5 36.85,29.5 R24.2 35.59,28.5 34.77,29.33 33.53,29.33 31.83,27.62 30.84,27.62 29.8,26.58 JP5.7
!A2
  Top 0.254: U4.9 41.55,22.55 40,21 35.15,21 R22.1 32.2,19.5 31.7,20 29.77,20 JP5.13
!B1
  Top 0.254: JP5.9 30.19,25.5 R21.1 34.98,26.33 36.47,26.33 37.12,25.67 40.12,25.67 40.28,25.51 40.28,24.68 40.12,24.52 39.59,24.52 U4.7
!B2
  Top 0.254: JP5.15 29.77,17.46 31.82,17.46 32.78,16.5 R25.1 34.98,17.33 36.47,17.33 36.66,17.14 U5.6
!I1
  Top 0.254: U4.15 42.67,30.18 41.5,29 41.5,24.4 40.3,23.2 37.4,23.2 37.1,23.5 36.5,23.5 35.85,22.85 R23.2 35.02,23.33 33.03,23.33 32.25,22.54 29.77,22.54 JP5.11
!I2
  Top 0.254: JP5.17 29.8,13.88 30.84,14.92 32.73,14.92 R26.1 35.24,14.6 U5.8 38.9,14.5
!MCLR  (via drill 0.4)
  Top 0.254: SV1.1 55.5,43.76 55.5,43 57,41.5 57,40.52 R1.1 57.45,39.55 57.5,39.5 57.5,38.7 v57,38.2 | v58.5,22.5 58.13,22.13 U1.18
  Bottom 0.254: v58.5,22.5 58.5,23 57,24.5 52.5,24.5 52,25 52,37.7 52.5,38.2 v57,38.2
+3V3  (via drill 0.4)
  Top 0.254: 36.5,42.5 v37.5,43.5 | U1.17 57.33,19.02 C2.1 | U1.28 63.24,26.65 | 60.04,26.54 61,26.5 | U1.40 56.52,33.49
  Top 0.406: 56.53,33.12 56.52,33.49 C1.1 | 63.24,26.65 C3.1 | 56.53,30.47 U1.40 | 57.33,23.33 U1.17 | R1.2 60.53,39.97 v61,39.5 | U2.4 52,13.5 v52.5,14 | U3.4 62.5,12.5 63.3,11.7 63.3,10.3 63,10 v63,9 | U9.4 72,12
  Top 0.61: U8.2 36.5,42.5 | U1.28 v60.5,26.54 60.04,26.54 | 61,26.5 58,26.5 | 58,26.5 v56.5,28 v56.5,30 56.5,30.44 56.53,30.47 | 57.33,23.33 57.33,25 | 57.33,25 57.33,25.83 58,26.5 | v54.5,23 54.5,24 55.5,25 57.33,25 | v75,13.5 73.5,12 72,12
  Top 0.813: U8.2 36.5,38 35.5,37 | C1.1 55.85,35.15 55,36 36,36 35.5,37 | C13.1 33.95,37 35.5,37 | SV1.2 56.77,43.23 58.5,41.5 59,41.5 59.45,41.05 R1.2 | U8.4 36.6,45.5 36.64,45.5 36.54,45.6 U8.4
  Bottom 0.406: v61,39.5 61,37 58.5,34.5 57.02,34.5 56.51,33.99 56.51,30.49 56.53,30.47
  Bottom 0.61: 56.53,30.47 56.53,28.03 v56.5,28 | v54.5,23 55,23 55.5,22.5 55.5,18.5 55,18 53.5,18 52.5,17 v52.5,14 52.5,9 54,7.5 61.5,7.5 v63,9 | v75,13.5 73.5,15 73.5,25.5 72.5,26.5 61.54,26.5 v60.5,26.54
  Bottom 0.813: JP3.1 JP3.7
  other vias: 35.5,47.5 37.5,47.5 39.5,47.5 33.5,45.5 39.5,45.5 35.5,43.5 39.5,43.5 35.5,41.5 37.5,41.5 39.5,41.5 33.5,43.5 33.5,41.5 33.5,47.5 35.5,45.5 37.5,45.5
  pour Top: 32.5,40.5 40.5,40.5 40.5,48.5 32.5,48.5
  pour Bottom: 32.5,40.5 40.5,40.5 40.5,48.5 32.5,48.5
  pour Top: 41.1,51.5 41.1,48.5 40.6,48 31.8,48 31.3,48.5 31.3,51.4 31.8,51.9 40.7,51.9
+5V  (via drill 0.35, 0.4)
  Top 0.254: 38.57,27.5 U4.4
  Top 0.406: v44.5,41.5 v44.5,43.5 | SV2.2 82.9,55.3 80,55.3
  Top 0.508: JP3.9 41.5,51.86 41.5,54.5 v42.5,55.5
  Top 0.61: U7.2 47.5,42.5 | U4.12 45.37,26.36 v46,26.5 | v37,27 37.5,27.5 38.57,27.5 | U4.16 45.74,31.45 v46,31.7 | U5.1 41.91,14.6 41.5,15 v41.5,20 | v67.5,42.5 68,42.5 68.92,41.58 LED1.4 | LED2.A 73.5,42.5 72.5,43.5 v69,43.5
  Top 0.813: U8.3 41.4,39.4 42,40 C12.1 42.15,41.5 v44.5,41.5 | 80,55.3 79.5,54.8 79.5,51 74.5,46 69.5,46 69,45.5 v69,43.5 68,42.5 | v67.5,42.5 v65.5,42.5 v63.5,42.5 | v42.5,78.5 v42.5,63.5 | U7.4 47.54,45.6 47.64,45.5
  Bottom 0.305: U$1.P11 34.95,80.56 36.79,80.56 38,79.35 38,79
  Bottom 0.61: 41.5,26.5 v46,26.5 v46,31.7 46,37.9 U7.2 47.5,42.5 v46.5,43.5 | 41.5,26.5 37.5,26.5 v37,27 | v41.5,20 41.5,26.5
  Bottom 0.813: v50.5,41.5 51.5,42.5 v63.5,42.5 v65.5,42.5 v67.5,42.5 68,42.5 v69,43.5 | v42.5,78.5 42,79 38,79 | v42.5,63.5 v42.5,55.5 | JP3.9 JP3.15
  other vias: 46.5,47.5 48.5,47.5 50.5,47.5 44.5,45.5 50.5,45.5 48.5,43.5 50.5,43.5 48.5,41.5 46.5,41.5 44.5,47.5 46.5,45.5 48.5,45.5
  pour Top: 43.5,40.5 51.5,40.5 51.5,48.5 43.5,48.5
  pour Bottom: 43.5,40.5 51.5,40.5 51.5,48.5 43.5,48.5
  pour Top: 42.3,51.9 50.9,51.9 51.2,51.6 51.2,48 42.4,48 41.9,48.5 41.9,51.5
+6V3  (via drill 0.4)
  Top 0.406: 49.6,39.19 U7.3
  Top 0.61: 74.7,48.9 74.7,50.85
  Top 0.813: 72,47.8 68.6,47.8 68.15,48.25 R9.2 68.15,47.85 | 72,47.8 73.6,47.8 74.7,48.9 | v68.5,47.5 v71.5,47.5 71.7,47.5 72,47.8 | U7.3 50.21,39 53.5,39 | C11.1 53.5,39 | 53.5,39 v55.5,39 | R13.2 58,61.5 v57.5,61 v57.5,59
  Bottom 0.813: v70,47.5 v68.5,47.5 63.5,47.5 63,48 63,56 62,57 57.5,57 v57.5,60 v57.5,61 | v70,47.5 72,47.5 | v70,47.5 70.5,47 70.5,42.5 69,41 57.5,41 v55.5,39 v51.5,39 | JP3.17 56.13,50.63
  Bottom 1.016: 56.13,50.63 57.5,52 57.5,57
  pour Top: 72.5,56.5 78,56.5 78.5,56 78.5,51.5 76,49 73.5,49 73.5,51.5 72.5,52.5
  pour Top: 52.5,51.9 56.2,51.9 56.7,51.4 56.7,49.8 56.2,49.3 52.6,49.3 52,49.9 52,51.4
A1
  Top 0.254: U4.2 38.17,30.18 37.5,29.5 37.5,28.5 36.67,27.67 34.73,27.67 33.91,28.5 R24.1 32.23,26.58 JP5.8
A2
  Top 0.254: U4.10 45.17,23.82 45.9,23.1 45.9,22.2 45.2,21.5 41.5,21.5 40.2,20.2 36.7,20.2 36,19.5 | JP5.14 33.24,18.96 33.53,18.67 35.17,18.67 36,19.5 | R22.2 36,19.5
A_IN0
  Top 0.254: 51.15,14.15 U2.3 | 50.15,14.15 U2.3 | U2.3 49.65,14.15 49.5,14 49.5,13.5 48.5,12.5 48.5,12 47,10.5 40.5,10.5 40,10 39,10 38.57,9.57 JP4.19
A_IN1
  Top 0.254: 50.85,12.85 U2.5 49.85,12.85 49,12 49,11.5 47.5,10 41.5,10 41.11,9.61 JP4.17
A_IN2
  Top 0.254: U2.10 53.85,12.85 53.5,12.5 53.5,11.5 53,11 50.5,11 48.5,9 44,9 43.65,8.65 JP4.15
A_IN3
  Top 0.254: U2.12 58.65,14.15 59,13.8 59,12.5 58.5,12 58,12 57.5,11.5 57.5,11 56.5,10 51.5,10 49.5,8 47,8 46.19,7.19 JP4.13
A_IN4
  Top 0.254: 60.65,13.15 U3.3 60.15,13.15 60,13 60,11.5 59.5,11 59,11 58.5,10.5 58.5,10 57.5,9 52.5,9 50.5,7 49,7 48.73,6.73 JP4.11
A_IN5
  Top 0.254: U3.5 62.15,11.85 62.5,11.5 62.5,10.5 62,10 62,9 61,8 53.5,8 51.27,5.77 JP4.9
A_IN6  (via drill 0.4)
  Top 0.254: v55,1 62,1 64,3 67.5,3 68.15,2.35 R14.3
  Bottom 0.254: JP4.7 55,3.58 v55,1
A_IN7  (via drill 0.4)
  Top 0.254: v72,3 73.15,1.85 R15.3
  Bottom 0.254: JP4.5 57.5,3.62 57.5,1.5 58,1 62,1 63.5,2.5 65,2.5 66,3.5 71.5,3.5 v72,3
A_IN8  (via drill 0.4)
  Top 0.254: v77.5,3.5 78.15,2.85 R16.3
  Bottom 0.254: JP4.3 60.16,3.5 62.5,3.5 63,3 64.5,3 65.5,4 77,4 v77.5,3.5
AN0
  Top 0.254: JP4.20 37.5,3.3 37.5,10 38,10.5 39.5,10.5 40,11 46.5,11 48,12.5 48,13 49,14 49,14.5 49.3,14.8 U2.2 | U2.2 U2.1 50.6,16.6 51,17 58.5,17 59,17.5 58.93,17.57 U1.19 | 50.8,14.8 U2.2 | 50.3,14.8 U2.2
AN1
  Top 0.254: U2.7 U2.6 52.7,12.2 53,12.5 53,13 53.5,13.5 53.5,16 54,16.5 59,16.5 59.73,17.23 U1.20 | JP4.18 42.4,3.52 42.4,8.9 43,9.5 48,9.5 50.05,11.55 U2.7 | 51.55,11.55 U2.7
AN2  (via drill 0.4)
  Top 0.254: JP4.16 44.9,3.48 44.9,7.9 45.5,8.5 49,8.5 51,10.5 56,10.5 56.5,11 56.5,11.45 U2.8 U2.9 56.2,12 v54.5,12 | v54.5,15 55.5,16 59.5,16 60.53,17.03 U1.21
  Bottom 0.254: v54.5,15 v54.5,12
AN3
  Top 0.254: U2.14 U2.13 58.7,14.8 59.5,14 59.5,12 59,11.5 58.5,11.5 58,11 58,10.5 57,9.5 52,9.5 50,7.5 48,7.5 47.5,7 47.5,3.54 JP4.14 | U2.14 56.5,15.55 | U1.22 61.33,16.83 60,15.5 57.45,15.5 U2.14
AN4  (via drill 0.4)
  Top 0.254: JP4.12 50,3.5 50,6 50.5,6.5 51,6.5 53,8.5 58.5,8.5 59,9 v59.5,9 | U3.1 U3.2 v62.5,13.8 | U1.23 63.13,22.13 62,21 62,15.35 U3.1 | 61,14.55 U3.1
  Bottom 0.254: v62.5,13.8 59.8,13.8 59.5,13.5 v59.5,9
AN5  (via drill 0.4)
  Top 0.254: U3.6 U3.7 61,10.45 v61,9.7 | U1.24 64.16,23.34 64.5,23 64.5,22 64,21.5 63.5,21.5 62.5,20.5 62.5,16 63.5,15 v63.5,13 63.5,12.5 64,12 64,8.5 63.5,8 62,8 61.5,7.5 54,7.5 52.5,6 52.5,3.46 JP4.10
  Bottom 0.254: v61,9.7 60,10.7 60,12.5 60.5,13 v63.5,13
AN6
  Top 0.254: U3.9 U3.8 65.05,10.55 64.75,10.25 | JP4.8 54.23,2.23 55.1,3.1 55.1,5.6 56.5,7 62,7 62.5,7.5 64,7.5 64.5,8 64.5,10 64.75,10.25 | U1.25 63.27,24 64.5,24 65,23.5 65,21.5 64.5,21 64,21 63,20 63.05,19.95 63,19.9 63,16.5 64,15.5 64,14 64.5,13.5 64.5,10.5 64.75,10.25
AN7
  Top 0.254: U3.13 U3.14 66.05,14.45 66,14.5 65,14.5 64.5,15 64.5,16 63.5,17 63.5,19.5 64.5,20.5 65,20.5 65.5,21 65.5,24 64.5,25 63.19,25 U1.26 | U3.13 67,13.9 | JP4.6 57.6,3.48 57.6,6 58.1,6.5 62.5,6.5 63,7 64.5,7 65,7.5 65,9.5 65.5,10 68,10 68.5,10.5 68.5,13.5 68.2,13.8 U3.13
AN8
  Top 0.254: JP4.4 60.1,3.44 60.1,5.5 60.6,6 63,6 63.5,6.5 64.7,6.5 65.5,7.3 65.5,9 66,9.5 68.5,9.5 69,10 69,14 69.5,14.5 | 69.5,14.5 76,14.5 76.4,14.1 U9.14 U9.13 | U1.27 64.76,25.74 66,24.5 66,20.5 65.5,20 65,20 64,19 64,17.5 65,16.5 65,15.5 65.5,15 68,15 68.5,14.5 69.5,14.5
B1
  Top 0.254: U4.6 38.61,25 36.35,25 R21.2 34.39,24.04 JP5.10 31.31,24
B2
  Top 0.254: 39,18.5 U5.5 | 31.42,16.42 JP5.16 32.28,16.42 33.03,15.67 35.02,15.67 R25.2 40.06,16.5 40.28,16.72 40.28,17.55 40.12,17.71 39.59,17.71 U5.5 | 38.8,18.5 U5.5
BLUE
  Top 0.254: R3.1 63.35,36.35 65,38 67.5,38 68.08,38.58 LED1.2
CS0
  Top 0.254: U1.12 53.07,21 47.5,21 47,20.5 47,16 46,15 46,14.5 44.5,13 38,13 37.41,12.41 37.18,12.41 36.28,11.5 33.08,11.5 31.98,12.6 29.99,12.6 JP5.19
CS1
  Top 0.254: U1.13 54.13,19.63 54,19.5 53,19.5 52,20.5 48,20.5 47.5,20 47.5,15.5 46.5,14.5 46.5,14 45,12.5 38.5,12.5 38,12 37.35,12 36.42,11.07 31.54,11.07 JP5.20
GND  (via drill 0.35, 0.4)
  Top 0.254: 64.5,55.5 64.5,54 U6.PAD | U1.39 57.33,33.33 57.63,33.33 v58,33.7 | U3.11 v65.3,12.5 | U6.5 64.5,53
  Top 0.305: 69.5,53.5 U6.7 67.5,53.5 | 69.5,53.5 70.2,52.8 70.6,52.8 70.6,53.5 69.9,53.5 | 69.5,53.5 69.9,53.5 | 69.9,53.5 70.4,53 70.4,53.2 70.3,53.3 71.05,53.3 R11.1 | v20.6,61.3 20,60.8
  Top 0.406: U1.6 51.57,26.5 v53.5,26.5 | v56,23.5 56.53,22.97 U1.16 56.53,18.38 C2.2 | v61,28 61.66,27.34 U1.29 64.89,27.34 C3.2 | C12.2 v42,45.5 | C4.2 47.79,24 v49.9,24 | U2.11 57.5,13.5 v58,13 | 78,12 v78.2,12
  Top 0.508: 64.5,55.5 62.35,57.5 62.35,58.5 C9.1 | R20.1 22.35,82.15 v22.5,82.3 | C19.1 v16.4,79.8 | C37.1 v16.4,61.3 v20.6,61.3 R47.1 | C39.1 14.65,44.65 v14.5,44.8 | R48.1 22.35,44.65 v22.5,44.8
  Top 0.61: R18.1 70.5,7.35 70.5,7 70,6.5 v69.5,6.5 | v74.5,6.5 74.5,7 74.65,7 R19.1 | U5.4 44.1,19.9 v44,20 | U4.8 37.85,22.55 v37,22.5 | v77,21 77.25,21.25 | 77.25,21.25 77.85,21.85 C6.2 | 77.25,21.25 77.25,20.75 78,20 78,16.65 C7.2 78.5,16.5 79,16 79,13 78,12 U9.11 | C1.2 55.75,37.3 v54.7,37.3 | C11.2 53.55,42 | R17.1 v66.5,8 | v77.5,35 78.35,34.15 C5.2 78.35,29.35 v77,28 77.9,27.1 77.9,23 | C14.2 73,51 v71.5,49.5 | LED3.C 66.05,62.95 v65,64
  Top 0.813: JP5.1 32.23,37.02 C13.2 32.15,38.65 v32.5,39 33.79,39 U8.1 | U7.1 43.9,39.4 v43.5,39 | 53.55,42 53.5,42 52.5,43 52.5,46.5 v53,47
  Top 1.016: CR1.2 16.4,42.7 C39.1 | U$1.P9 U$1.P10 37.6,81.9 v38,81.5
  Bottom 0.254: v65.3,12.5 67,12.5 67,8 v66.5,8
  Bottom 0.61: 49.5,60 49,60
  other vias: 66.5,51.5 66.5,46 66,54 38,82.5 39,82.5 39,81.5 38,80.5 39,80.5
  pour Top: 64.5,46 64.5,55.5 65,56 67,56 67.5,55.5 67.5,52.5 68,52 68.5,52 69,51.5 69,50.5 68.5,50 67.5,50 67.5,45 65,45
  pour Bottom (isolate 0.305, rank 3): 3,99 arc90 0,96 0,3 arc90 3,0 83.5,0 arc90 86.5,3 86.5,96 arc90 83.5,99
  pour Top: 33,82.9 32.5,82.4 32.5,81.3 33.1,80.7 37,80.7 37.5,80.2 37.5,80 38,79.5 40.5,79.5 41,80 41,81.9 40,82.9
GPIO1  (via drill 0.4)
  Top 0.254: 63.27,28 U1.30 64.64,28.14 65,28.5 65,29 65.5,29.5 66.5,29.5 67,29 67,26 66.5,25.5 66.5,20 v65,18.5 | JP4.1 61.86,5.2 v63.2,5.2
  Bottom 0.254: v63.2,5.2 64,6 67,6 68,7 68,16.5 67.5,17 67,17 66.5,17.5 65.5,17.5 65,18 v65,18.5
GPIO2  (via drill 0.4)
  Top 0.254: U1.31 63.94,28.94 65,30 67,30 67.5,29.5 67.5,25.5 67,25 67,19.5 66.5,19 v66.5,18.5 | JP4.2 v63.2,4
  Bottom 0.254: v63.2,4 64.2,5 67.5,5 68.5,6 68.5,17 68,17.5 67.5,17.5 v66.5,18.5
GREEN
  Top 0.254: LED1.3 66.35,38.5 64.5,38.5 63.5,37.5 62,37.5 61,36.5 R4.1
I1
  Top 0.254: U4.14 42.41,28.91 42,28.5 42,23.7 39.9,21.6 34.55,21.6 R23.1 33.15,21.5 JP5.12
I2
  Top 0.254: JP5.18 32.48,12.67 35.02,12.67 R26.2 40,13.5 40,13.9 40.28,14.18 40.28,15.01 40.12,15.17 39.59,15.17 U5.7
INDX1
  Top 0.254: U4.13 45.13,27.64 45.5,28 45.5,29.5 46,30 48.2,30 50.06,28.14 U1.4
INDX2
  Top 0.254: U5.3 45.13,17.14 46,18 46,21.5 46.5,22 49.5,22 50.84,23.34 U1.10
MISO  (via drill 0.4)
  Top 0.254: U1.37 58.93,29.57 v59.5,29
  Bottom 0.254: v59.5,29 59.5,32 60.5,33 80,33 80.5,32.5 80.5,31.5 80.79,31.21 SV2.21
MOSI  (via drill 0.4)
  Top 0.254: U1.38 58.13,28.37 v58.5,28
  Bottom 0.254: v58.5,28 58.5,32.5 59.5,33.5 81.42,33.5 SV2.19
N$1
  Top 0.254: R15.2 72.85,6.35 R18.2 | R18.2 72.5,8.35 | U9.5 73.15,11.35 73.5,11 73.5,8.5 73,8 R18.2
N$2
  Top 0.254: U1.7 49.25,25.74 C4.1
N$4
  Top 0.254: U9.12 77.65,12.65 78,13 78,14.5 77.5,15 76.5,15 76,15.5 76,16.35 C7.1 74,16.5 73.5,17 R7.2
N$5  (via drill 0.4)
  Top 0.254: C5.1 R5.2 73,36 72.5,36.5 70.5,36.5 68.5,34.5 68.5,25 v68,24.5 | U3.10 65.85,11.85 v65.5,11.5
  Bottom 0.254: v65.5,11.5 65,11.5 64.5,12 64.5,17.5 64,18 64,19 65,20 66.5,20 67,20.5 67,23.5 v68,24.5
N$6
  Top 0.508: 18.5,88 C18.2 C19.2
  pour Top: 21.5,96 21,96.5 2,96.5 1.5,96 1.5,92.5 2,92 13.5,92 14,91.5 14,88 14.5,87.5 21,87.5 21.5,88
N$8  (via drill 0.35)
  Top 1.016: U$1.P1 U$1.P2
  other vias: 23.5,93.5 23.5,92.5 23.5,91.5 23.5,90.5
  pour Top: 22.5,88 22.5,96 23,96.5 39,96.5 39.5,96 39.5,91 39,90.5 31,90.5 30.5,89.5 28.5,87.5 23,87.5
  pour Bottom: 22.5,96 22.5,88 23,87.5 28.5,87.5 30.5,89.5 30.5,96 30,96.5 23,96.5
N$9
  Bottom 0.254: U$1.P13 32.5,75.57 32.5,69 32,68.5 22.5,68.5 22,69 22,73 21.5,73.5 4.95,73.5 X6.5
N$10
  Top 0.254: U9.3 69.65,12.65 69.5,12.5 69.5,8.65 R17.2 69,7.65 69,7.5 68.5,7 67,7 66.5,6.5 R14.2
N$11
  Top 0.508: C18.1 19.15,82.15 19.5,82.5 19.5,83.5 19.85,83.85 R20.2
N$12
  Bottom 0.254: U$1.P15 33.75,73.41 34.93,72.23 34.93,70.86 32.17,68.09 32.09,68.09 32,68 22,68 21.5,68.5 X6.6
N$13  (via drill 0.35)
  Top 0.254: U$1.P17 35.5,69.99 v35.5,68.5
  Bottom 0.254: v35.5,68.5 33.5,68.5 32.5,67.5 9,67.5 4.92,63.42 X6.7
N$14
  Bottom 0.254: U$1.P22 40.32,76.82 39.5,76 39.5,68 38.5,67 9.5,67 7.5,65 7.5,60 5.84,58.34 X6.8
N$15
  Bottom 0.254: U$1.P21 40.78,74.28 40,73.5 40,67.5 39,66.5 10,66.5 8,64.5 8,56.5 4.87,53.37 X6.9
N$16  (via drill 0.4)
  Top 0.254: U9.6 U9.7 72.45,10.05 v72.5,10 | R6.3 70,28 69.5,27.5 v69.5,18.5
  Bottom 0.254: v69.5,18.5 69.5,15 70,14.5 73,14.5 73.5,14 73.5,10.5 73,10 v72.5,10
N$17
  Bottom 0.254: U$1.P20 41.24,71.74 40.5,71 40.5,67 39.5,66 10.5,66 8.5,64 8.5,51.81 X6.10
N$18  (via drill 0.4)
  Top 0.254: U9.8 U9.9 74.8,10.7 v74.5,11 | v74.5,15.5 71,15.5 70.5,16 70.5,20.15 R7.3
  Bottom 0.254: v74.5,15.5 79,15.5 79.5,15 79.5,11 79,10.5 75,10.5 v74.5,11
N$19
  Bottom 0.254: U$1.P19 41.7,69.2 41,68.5 41,66.5 40,65.5 11,65.5 9,63.5 9,47.23 X6.11
N$20
  Top 0.406: U$1.P29 79.97,94.6 X5.1
N$21
  Top 0.406: U$1.P28 77.42,92.06 X5.2
N$22
  Top 0.406: U$1.P27 74.89,89.52 X5.3
N$23
  Top 0.61: R13.1 LED3.A
N$24
  Top 0.508: 18.5,69.5 C36.2 C37.2
  pour Top: 1.5,90.5 2,91 13,91 13.5,90.5 13.5,81 17,78 21,78 21.5,77.5 21.5,69.5 21,69 14.5,69 14,69.5 14,74.5 10,78.5 10,86 9.5,86.5 2,86.5 1.5,87
N$25
  Top 0.254: R8.2 67.95,37 73,37 73.5,37.5 LED2.C
N$26
  Top 0.254: U$1.P26 72.37,86.96
  Top 0.406: 72.37,86.96 X5.4
N$27
  Top 0.254: 80.86,73.64 X5.5
  Top 0.406: U$1.P25 72.06,84.44 77.5,79 77.5,77 80.86,73.64
N$28
  Top 0.254: U1.35 60.5,32.37 60.5,34 61,34.5 R4.2
N$29
  Top 0.254: U1.34 63.1,34.11 R3.2
N$30
  Top 0.254: R2.2 63.13,32.58 U1.33
N$31
  Top 0.254: R16.2 77.35,5.85 R19.2 77.5,8.15 77.5,11 77.15,11.35 U9.10
N$32
  Top 0.254: U1.32 63.74,29.74 64.5,30.5 64.5,32.5 65.5,33.5 67,33.5 67.3,33.8 R8.1
N$33
  Top 0.305: 69,56 69.5,55.5 69.5,54.8 69.2,54.5 U6.9
  Top 0.61: C10.1 66,59 69,56
  Top 0.813: C10.1 65.85,58.55 68.7,61.4 D1.C
  pour Top: 67,64 67.5,64.5 78,64.5 78.5,64 78.5,62 78,61.5 67.5,61.5 67,62
N$34
  Top 0.406: X5.6 75.5,73.67 75.5,78.25 U$1.P24
N$35
  Top 0.152: 69.3,53 U6.6
  Top 0.305: 69.3,53 69.8,52.5 69.8,51.05 R10.2 R9.1
N$36
  Top 0.305: U6.2 62.8,54.5 61.5,53.2 61.15,53.2 R12.1
N$37
  Top 0.305: U6.4 62.7,53.5 62.2,53 62.2,51.4 62.6,51 C15.1
N$38
  Top 0.305: R11.2 71.05,54.85 70.7,55.2 70,55.2 70,54.6 69.8,54.4 | 69.4,54 70.2,54 70.7,54.5 70.7,55 70.3,55 70.3,54.7 70.2,54.6 70.4,54.6 70.4,54.7 | 70.4,54.7 70.5,54.8 | 70.4,54.7 69.9,54.2 70.1,54.2 70.3,54.4 69.8,54.4 | 69.8,54.4 69.4,54 | 69.4,54 U6.8
  Top 0.61: D1.A 71.2,56.15 71.2,55.9 | 71.2,55.9 70.7,55.9 | 70.7,55.9 68.4,58.2 | 70.7,55.9 71.2,55.4 | 71.2,55.4 71.2,55.9 | 71.2,55.4 R11.2
N$39
  Top 0.305: C10.2 64.15,57.35 64.9,56.6 67.3,56.6 68.4,55.5 U6.10
N$41
  Top 0.508: C36.1 19.15,63.65 19.5,64 19.5,65 19.85,65.35 R47.2
N$44  (via drill 0.4)
  Top 0.254: U9.2 U9.1 72.05,13.95 v72.5,13.5 | R5.3 70,35 69,34 69,19.5 v68,18.5
  Bottom 0.254: v68,18.5 69,17.5 69,14.5 69.55,13.95 72,13.95 72.45,13.5 v72.5,13.5
N$57  (via drill 0.4)
  Top 0.254: 73.5,24.5 R6.2 | C6.1 74.65,24 R6.2 | R6.2 72,23 v70.5,23 | v68,23 67.7,22.7 67.7,19.5 67.2,19 67.2,17.7 66.5,17 v66.5,16 | v65.4,13.6 65.75,13.15 U3.12
  Bottom 0.254: v70.5,23 v68,23 | v66.5,16 66.5,14.4 v65.4,13.6
N$62
  Top 0.508: C39.2 C38.2 18.5,51
  pour Top: 2,86 1.5,85.5 1.5,82 2,81.5 7,81.5 7.5,81 7.5,75.5 11,72 11,56.5 12,55.5 12,50.5 12.5,50 19,50 19.5,50.5 19.5,58.5 19,59 16,59 15,60 15,67 13.5,68 13.5,74 9.5,78 9.5,85.5 9,86
N$64
  Top 0.508: C38.1 19.15,44.65 19.5,45 19.5,46 19.85,46.35 R48.2
N$65  (via drill 0.35)
  Top 1.016: U$1.P3 U$1.P4
  other vias: 23.5,74 23.5,75 23.5,73 23.5,72
  pour Top: 22.5,69.5 23,69 29,69 29.5,69.5 29.5,77.5 29,78 23,78 22.5,77.5
  pour Bottom: 39,91 39.5,90.5 39.5,88.5 39,88 32.5,88 32,87.5 32,69.5 31.5,69 23,69 22.5,69.5 22.5,77.5 23,78 27,78 28,79 28,87 29,87 31,89 31,90.5 31.5,91
N$66  (via drill 0.35)
  Top 1.016: U$1.P6 U$1.P5
  other vias: 21.5,55 21.5,56 21.5,54 21.5,53
  pour Top: 39,88.5 39.5,88 39.5,86.5 39,86 32.5,86 32,85.5 32,65.5 27.5,61 27.5,50.5 27,50 21,50 20.5,50.5 20.5,58.5 21,59 22.5,59 23.5,60 23.5,67.5 24.5,68.5 29.5,68.5 30,69 30,86 32,88.5
  pour Bottom: 20.5,58.5 21,59 27,59 27.5,58.5 27.5,50.5 27,50 21,50 20.5,50.5
OC1
  Top 0.254: U1.14 54.93,19.43 54.5,19 52.5,19 51.5,20 48.5,20 48,19.5 48,15 47,14 47,13.5 45.5,12 39,12 38.41,11.41 37.33,11.41 35.77,9.84 30.84,9.84 29.8,8.8 JP5.21
OC2
  Top 0.254: U1.15 55.73,19.23 55,18.5 52,18.5 51,19.5 49,19.5 48.5,19 48.5,14.5 47.5,13.5 47.5,13 46,11.5 39.5,11.5 39,11 37.5,11 35.3,8.8 JP5.22
PGEC  (via drill 0.4)
  Top 0.254: U1.9 51.67,24 53.5,24 55,25.5 55,27.5 54.5,28 54.5,28.5 55,29 v55,29.5 | v59,36.5 59,37 59.5,37.5 60.5,37.5 61,38 62.5,38 63,38.5 63,41.5 62.5,42 62.5,43 63,43.5 63.5,43.5 64.39,44.39 SV1.5
  Bottom 0.254: v55,29.5 55,30 54.5,30.5 54.5,35 55,35.5 58,35.5 v59,36.5
PGED  (via drill 0.4)
  Top 0.254: U1.8 51.59,25 53.5,25 54.5,26 54.5,27 54,27.5 54,28.5 53.5,29 v53.5,29.5 | v58.5,38 60,38 60.5,38.5 62,38.5 62.5,39 62.5,41 61.85,41.65 SV1.4
  Bottom 0.254: v53.5,29.5 53.5,30 54,30.5 54,35.5 54.5,36 57.5,36 58,36.5 58,37.5 v58.5,38
PWR
  Top 0.305: U6.1 61,55 R12.2
  Top 0.406: 61,55 61,56
  Top 0.813: 61,56 60.15,56.85 C9.2
  Top 1.016: 40,84.5 39.94,84.44 U$1.P8 U$1.P7
  pour Top: 58.5,57 62,57 63,56 63,48.5 62,47.5 58.5,47.5 57.5,48.5 57.5,54 56.5,55 45.5,55 43.5,57 42,57 43,58 43,62 48,62 48,63 50,63 51,62 53.5,62
  pour Top (isolate 0.254): 50,57 50,82 46.5,85.5 32.5,85.5 32.5,83.7 33,83.3 40.5,83.3 44,79.8 44,62.5 43.5,62 38,62 37.5,61.5 37.5,60 35.5,58 29,58 28,57 28,50 27,49 24,49 23,48 23,44 22,43 20.5,43 19.5,42 19.5,34.5 20.5,33.5 26.5,33.5 27.5,34.5 27.5,43 30.5,46 30.5,53.5 32,55 40,55 42,57
PWR-PREFUSE
  pour Top: 2.5,21.5 1.5,22.5 1.5,37.5 2.5,38.5 18,38.5 19,37.5 19,30.5 18,29.5 13.5,29.5 12.5,28.5 12.5,22.5 11.5,21.5
QEA1
  Top 0.254: U4.3 39.41,28.91 39.5,29 40,29 40.5,29.5 40.5,30 43,32.5 49.5,32.5 50,32 50,30 50.26,29.74 U1.2
QEA2
  Top 0.254: U4.11 46.49,25.09 46.9,25.5 46.9,28 47.4,28.5 48.9,28.5 50.06,27.34 U1.5
QEB1
  Top 0.254: U4.5 40.37,26.36 41,27 41,29.4 42.4,30.8 48.7,30.8 49.5,30 49.5,29.5 50.06,28.94 U1.3
QEB2
  Top 0.254: U1.11 50.5,21.5 47,21.5 46.5,21 46.5,16.5 45.87,15.87 U5.2
RED
  Top 0.254: R2.1 66.35,37.5 68.5,37.5 68.92,37.92 LED1.1
SCK  (via drill 0.4)
  Top 0.254: v60.5,30 59.73,30.77 U1.36
  Bottom 0.254: SV2.23 80,30.34 80,32 79.5,32.5 61,32.5 60.5,32 v60.5,30
SCK2
  Top 0.254: U1.41 55.73,33.77 54.5,35 32.07,35 JP5.2
SCL1
  Top 0.254: U1.44 53.33,32.83 53.5,33 53,33.5 34.58,33.5 31.7,30.62 30.23,30.62 JP5.5
SDA1
  Top 0.254: U1.1 51.53,32.03 51.5,32.5 51,33 38,33 36.5,31.5 33.65,31.5 JP5.6
SDI2
  Top 0.254: U1.42 54.93,33.57 54,34.5 33.04,34.5 31.7,33.16 30.23,33.16 JP5.3
SDO2
  Top 0.254: U1.43 54.13,33.37 53.5,34 33.61,34 JP5.4
VDD
  pour Top: 1.5,20 1.5,9.5 2.5,8.5 12,8.5 13,7.5 13,6 14,5 19,5 20,6 20,24.5 19,25.5 14,25.5 13,24.5 13,22 12,21 2.5,21

### Text on the board
tPlace: W1 | ANIN1+ | W2 | ANIN1- | W3 | ANIN2+ | ANIN2- | ANOUT1 | HALL1 | ANOUT2 | HALL2 | HALL3 | DIGIN1 | GND | DIGIN2 | +3V3 | +5V | +6V3 | DIGIO3 | DIGIO4 | REV B | AN6 | SPI | I2C | AN7 | RC Filters | ENC1 | AN8 | ENC2 | MRRL | !SS | RasPIC GoPack | PWM | AN0 | AN1 | AN2 | AN3 | AN4 | AN5 | AN6 | AN7 | AN8 | GPIO
tNames: Power Switch | +Vdd | GND | Supply / Voltage